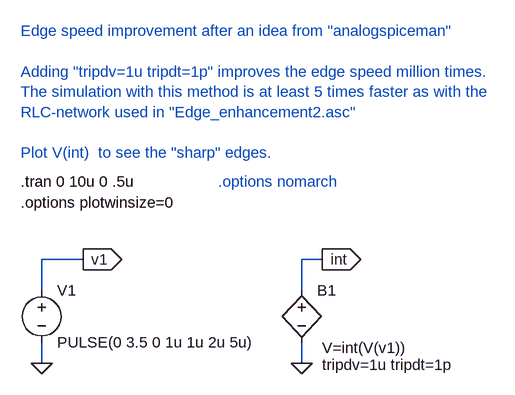
[diagram p0: schematic Edge_enhancement3.asc]
Edge_enhancement3.asc, the LTspice schematic file:
Version 4
SHEET 1 980 680
WIRE -96 32 -96 -16
WIRE -96 144 -96 112
WIRE -32 -16 -96 -16
WIRE 304 32 304 -16
WIRE 304 144 304 112
WIRE 336 -16 304 -16
FLAG 304 144 0
FLAG -96 144 0
FLAG -32 -16 v1
IOPIN -32 -16 Out
FLAG 336 -16 int
IOPIN 336 -16 Out
SYMBOL voltage -96 16 R0
WINDOW 123 0 0 Left 0
WINDOW 39 0 0 Left 0
SYMATTR InstName V1
SYMATTR Value PULSE(0 3.5 0 1u 1u 2u 5u)
SYMBOL bv 304 16 R0
WINDOW 39 32 130 Left 0
WINDOW 3 32 104 Left 0
SYMATTR SpiceLine tripdv=1u tripdt=1p
SYMATTR InstName B1
SYMATTR Value V=int(V(v1))
TEXT -128 -136 Left 0 !.tran 0 10u 0 .5u
TEXT -128 -104 Left 0 !.options plotwinsize=0
TEXT -128 -368 Left 0 ;Edge speed improvement after an idea from "analogspiceman"\n \nAdding "tripdv=1u tripdt=1p" improves the edge speed million times.\nThe simulation with this method is at least 5 times faster as with the \nRLC-network used in "Edge_enhancement2.asc"\n  \nPlot V(int)  to see the "sharp" edges.
TEXT 176 -136 Left 0 ;.options nomarch

The netlist it stands for:
* Edge_enhancement3.asc
V1 v1 0 PULSE(0 3.5 0 1u 1u 2u 5u)
B1 int 0 V=int(V(v1)) tripdv=1u tripdt=1p
.tran 0 10u 0 .5u
.options plotwinsize=0
* Edge speed improvement after an idea from "analogspiceman"
* Adding "tripdv=1u tripdt=1p" improves the edge speed million times.
* The simulation with this method is at least 5 times faster as with the
* RLC-network used in "Edge_enhancement2.asc"
* Plot V(int)  to see the "sharp" edges.
* .options nomarch
.backanno
.end